# Altium schematic sheet PowerStage.SchDoc: <Project Name>
size A3; ApprovedBy: <Appr.>; Author: <Author>; CompanyName: Infineon Technologies AG; Engineer: <Rel.>; Organization: Infineon Technologies AG; Address1: IFAG DES S PS; Address2: Am Campeon 1-12  -  85579 Neubiberg  -  Germany; Address3: 85579 Neubiberg; Address4: Germany; DocumentNumber: 5; Revision: <Rev.>; SheetNumber: 5; SheetTotal: 9; Release: RC00; PageSetup: Record=PageOptions|CenterHorizontal=True|CenterVertical=True|PrintScale=1.01|XCorrection=1.00|YCorrection=1.00|PrintKind=0|BorderSize=5000000|LeftOffset=0|BottomOffset=0|Orientation=2|PaperLength=1000|PaperWidth=1000|Scale=100|PaperSource=7|PrintQuality=-4|MediaType=1|DitherType=10|PaperKind=A3|PrintScaleMode=1; Doc_ConfidentialStatus: <Doc_ConfidentialStatus>; Doc_Preliminary: <Doc_Preliminary>
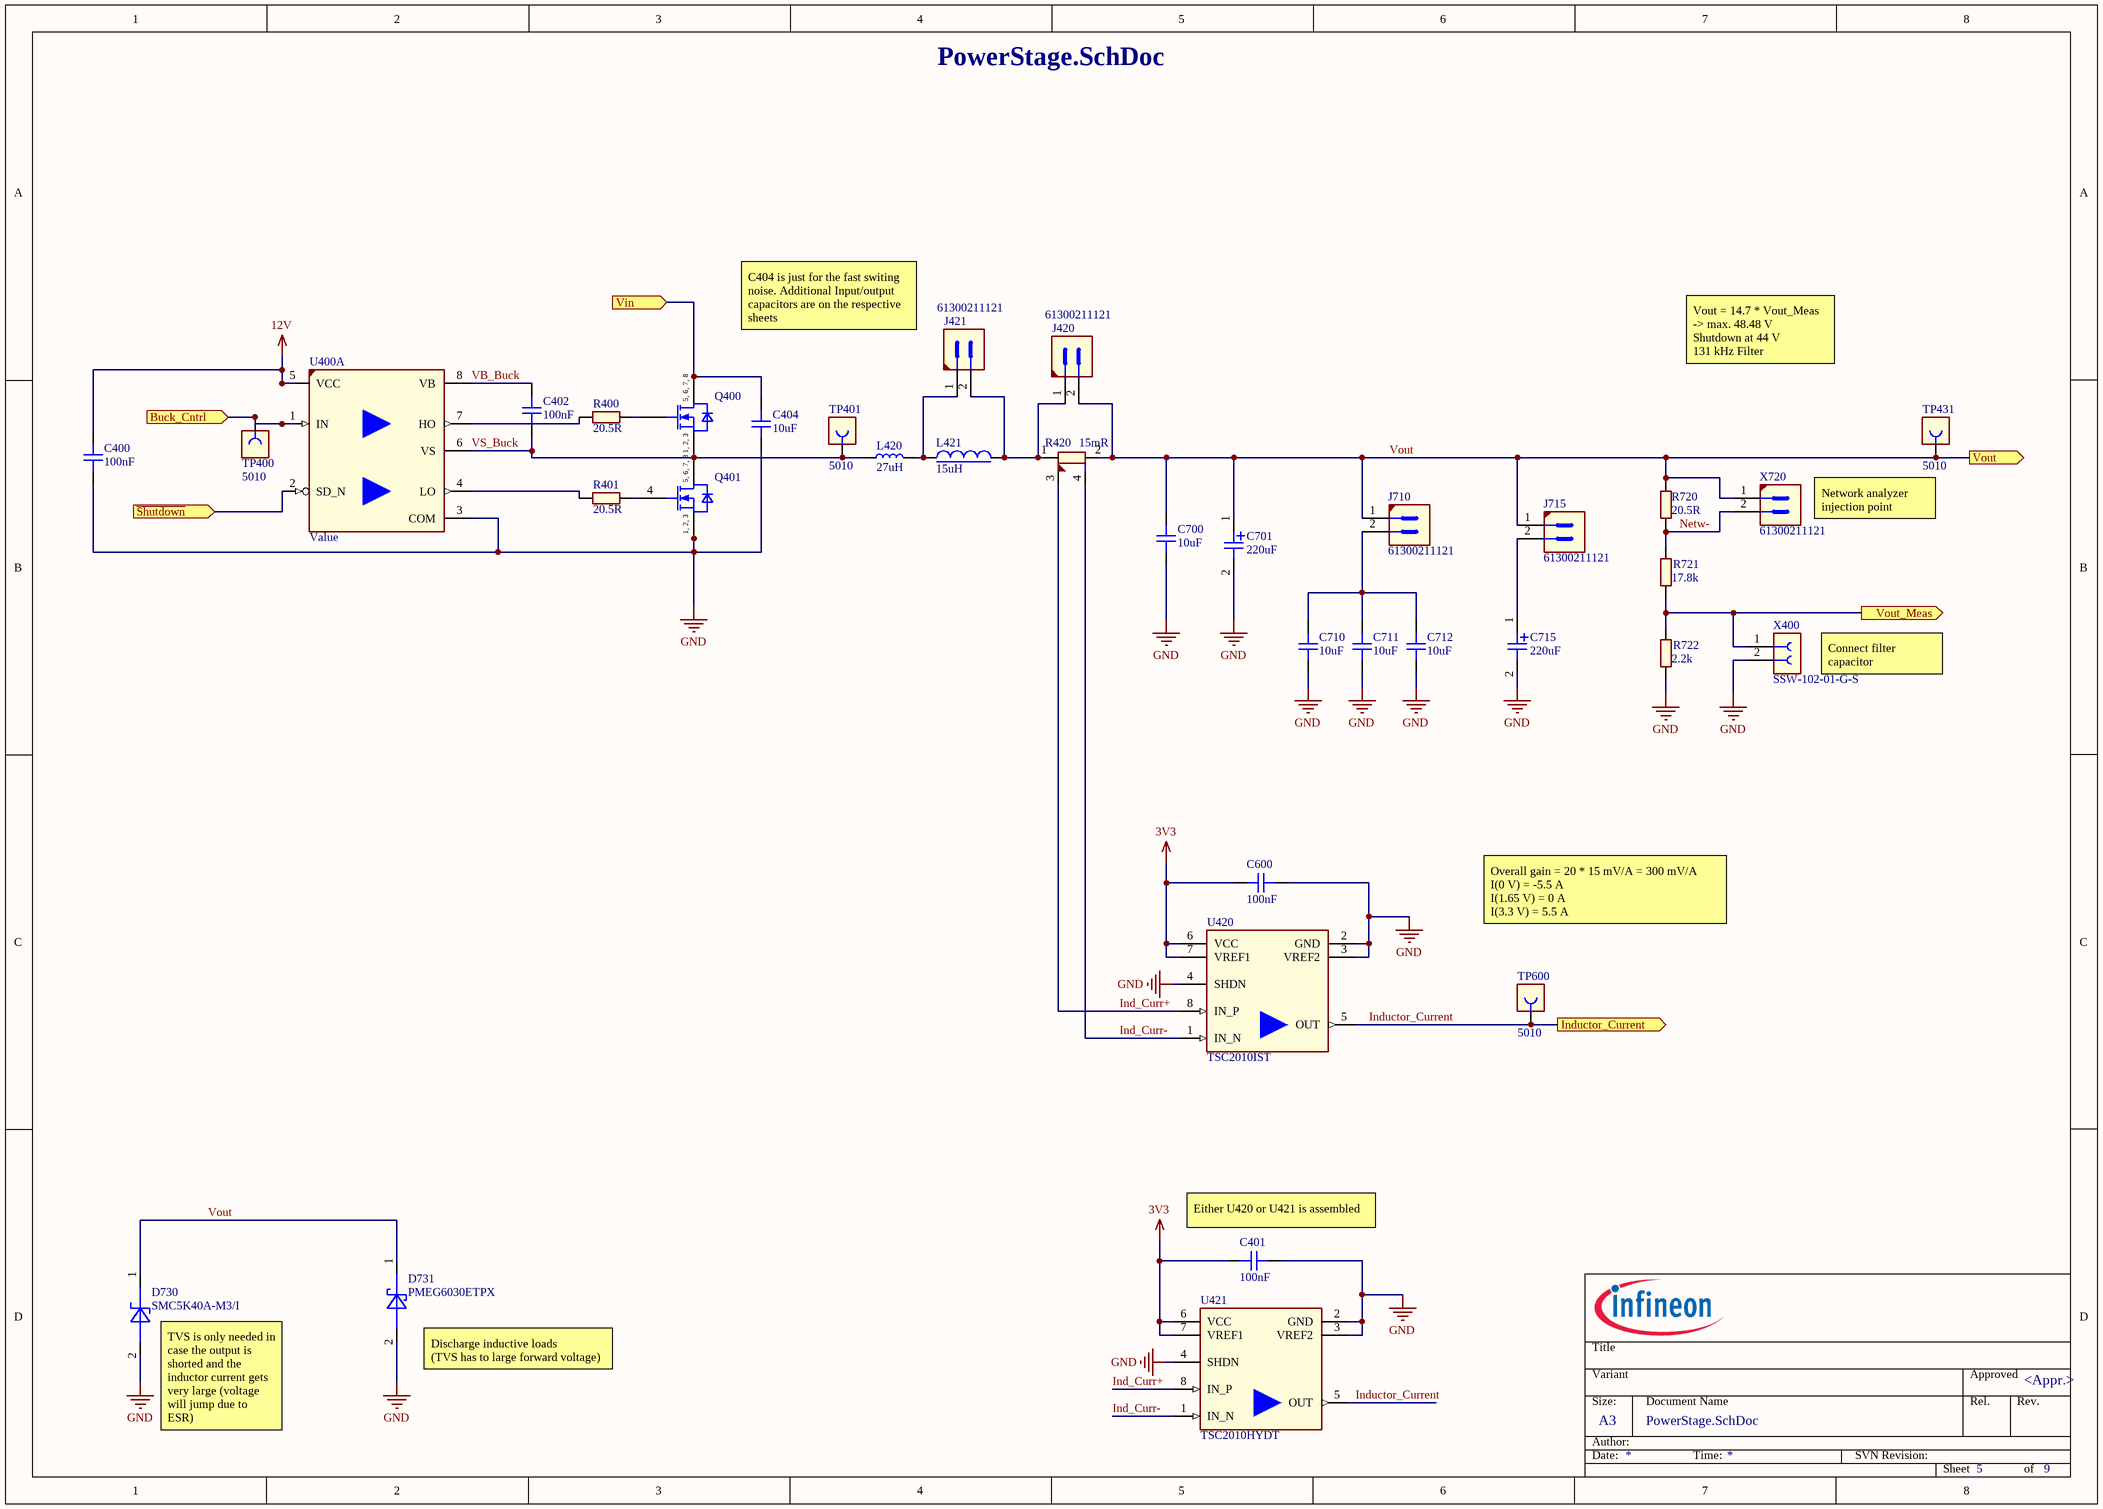
[diagram p0: PowerStage.SchDoc]

## Parts
C400  100nF  [CAPC3216X125N-0]
C401  100nF  [CAPC3216X125N-0]
C402  100nF  [CAPC3216X125N-0]
C404  10uF  [CAPC3216X190N-1]
C600  100nF  [CAPC3216X125N-0]
C700  10uF  [CAPC3216X190N-1]
C701  220uF  [CAPAE1030X1050N-3]
C710  10uF  [CAPC3216X190N-1]
C711  10uF  [CAPC3216X190N-1]
C712  10uF  [CAPC3216X190N-1]
C715  220uF  [CAPAE1030X1050N-3]
D730  SMC5K40A-M3/I  [DIOM7959X262N]
D731  PMEG6030ETPX  [SODFL4725X110N]
J420  61300211121  [CON-M-THT-61300211121]
J421  61300211121  [CON-M-THT-61300211121]
J710  61300211121  [CON-M-THT-61300211121]
J715  61300211121  [CON-M-THT-61300211121]
L420  27uH  [INDM120120X1000N]
L421  15uH  [IND-SMD-SRP6060FA]
Q400  igfet_n_ch_enh_dio_1s2s3s4g5d6d7d8d_8p  [INF-PG-PQFN-5X6BEG]  (value not drawn)
Q401  igfet_n_ch_enh_dio_1s2s3s4g5d6d7d8d_8p  [INF-PG-PQFN-5X6BEG]  (value not drawn)
R400  20.5R  [RESC3216X60N]
R401  20.5R  [RESC3216X60N]
R420  15mR  [RES-SMD-L4T12]
R720  20.5R  [RESC3216X60N]
R721  17.8k  [RESC3216X60N]
R722  2.2k  [RESC3216X60N]
TP400  5010  [CON-THT-TP-5010]
TP401  5010  [CON-THT-TP-5010]
TP431  5010  [CON-THT-TP-5010]
TP600  5010  [CON-THT-TP-5010]
U400  Value  [SOIC127P600X172-8N-1-V]  (part A of 3)
U420  TSC2010IST  [SOIC127P600X175-8N-16]
U421  TSC2010HYDT  [SOIC127P600X175-8N-16]
X400  SSW-102-01-G-S  [CON-F-THT-SSW-102-01-G-S]
X720  61300211121  [CON-M-THT-61300211121]

## Ports
Buck_Cntrl (in), Inductor_Current (out), Vin (in), Vout (out), Vout_Meas (out), ~{Shutdown} (in)

## Nets
3V3: C401.2 C600.2 U420.6(VCC) U420.7(VREF1) U421.6(VCC) U421.7(VREF1)
12V: C400.2 U400.5(VCC)
GND: C400.1 C401.1 C404.1 C600.1 C700.1 C701.2 C710.1 C711.1 C712.1 C715.2 D730.2(ANODE) D731.2(Anode) Q401.1(SOURCE) Q401.2(SOURCE) Q401.3(SOURCE) R722.2 U400.3(COM) U420.2(GND) U420.3(VREF2) U420.4(SHDN) U421.2(GND) U421.3(VREF2) U421.4(SHDN) X400.2
~{Shutdown}: U400.2(SD_N) ; port ~{Shutdown}
Buck_Cntrl: TP400.1 U400.1(IN) ; port Buck_Cntrl
Ind_Curr+: R420.3(I1) U420.8(IN_P) U421.8(IN_P)
Ind_Curr-: R420.4(I2) U420.1(IN_N) U421.1(IN_N)
Inductor_Current: TP600.1 U420.5(OUT) U421.5(OUT) ; port Inductor_Current
Netw-: R720.1 R721.2 X720.2
VB_Buck: C402.2 U400.8(VB)
Vin: C404.2 Q400.5(DRAIN) Q400.6(DRAIN) Q400.7(DRAIN) Q400.8(DRAIN) ; port Vin
Vout: C700.2 C701.1 D730.1(CATHODE) D731.1(Cathode) J420.2 J710.1 J715.1 R420.2(V2) R720.2 TP431.1 X720.1 ; port Vout
Vout_Meas: R721.1 R722.1 X400.1 ; port Vout_Meas
VS_Buck: C402.1 L420.1 Q400.1(SOURCE) Q400.2(SOURCE) Q400.3(SOURCE) Q401.5(DRAIN) Q401.6(DRAIN) Q401.7(DRAIN) Q401.8(DRAIN) TP401.1 U400.6(VS)
NetC710_2: C710.2 C711.2 C712.2 J710.2
NetC715_1: C715.1 J715.2
NetJ420_1: J420.1 J421.2 L421.2 R420.1(V1)
NetJ421_1: J421.1 L420.2 L421.1
NetQ400_4: Q400.4(GATE) R400.1
NetQ401_4: Q401.4(GATE) R401.1
NetR400_2: R400.2 U400.7(HO)
NetR401_2: R401.2 U400.4(LO)

## Notes on the sheet
- C404 is just for the fast switing noise. Additional Input/output capacitors are on the respective sheets
- Vout = 14.7 * Vout_Meas
  -> max. 48.48 V
  Shutdown at 44 V
  131 kHz Filter
- Network analyzer injection point
- (near X400) Connect filter capacitor
- Overall gain = 20 * 15 mV/A = 300 mV/A
  I(0 V) = -5.5 A
  I(1.65 V) = 0 A
  I(3.3 V) = 5.5 A
- (near C401) Either U420 or U421 is assembled
- (near D731) Discharge inductive loads
  (TVS has to large forward voltage)
- (near D730) TVS is only needed in case the output is shorted and the inductor current gets very large (voltage will jump due to ESR)
- Title
- Variant
- Approved
- Date:
- Author:
- Size:
- A3
- Document Name
- Time:
- SVN Revision:
- Rel.
- Rev.
- Sheet
- of
- (in symbol 584303) 5, 6, 7, 8; 1, 2, 3

## Library data of the parts
C400-C402 C600 = 282874: CAP / CERA / 100nF / 50V / 10% / X7R (EIA) / -55°C to 125°C / 1206(3216) / SMD / -; Multiple Parts: No; Legacy PartNumber: CAP01005660; Manufacturer: MuRata; Manufacturer Order Number: GRM31MR71H104KA01; Symbol Type: Capacitor; Single; Standard; 2 Pins; Alternate View: Yes; Article Number: 282874; Version Number: V01; Combined Parameters: TC:X7R (EIA);Tol.:-10%/+10%;Vdc:50V; QuickPick: 100nF / 50V / 10% / X7R (EIA) / 1206 (3216); Type: Standard; Style: Single; Package Metric: 3216; Package Imperial: 1206; ComponentStatus: Released; PLMStatus: Obsolete; Legacy DeviceID: CAP01005660; Part Type: Capacitor; Value: 100nF; Tolerance Neg: 10%; Tolerance Pos: 10%; Application: Standard; Technology: Ceramic; Temperature min: -55; Temperature max: 125; Temperature Range: Military; ROHS Compliant: Y; Automotive Qualified: No; PackageReference: 1206 (3216); ComponentLink1Description: Vendor WebSite; ComponentLink1URL: http://www.murata.com/; ComponentLink2Description: Datasheet; ComponentLink2URL: http://webnetprod.muc.infineon.com/PCBPortal_Prod/WorkFlows/AltiumComponent/StandardDocumentation?Versionid=282875; Supplier 1: Farnell; Supplier 2: DigiKey; Supplier 3: Mouser; Second Source allowed: Yes; Voltage DC (max): 50V; Package Description: Capacitor,non-polarized,Chip;3.20mm L X 1.60mm W X 1.25mm H
C404 C700 C710-C712 = 648992: CAP / CERA / 10uF / 50V / 20% / X5R (EIA) / -55°C to 85°C / 1206 (3216) / SMD / -; Multiple Parts: No; Manufacturer: Taiyo Yuden; Manufacturer Order Number: UMK316BBJ106ML-T; Symbol Type: Capacitor; Single; Standard; 2 Pins; Alternate View: Yes; Article Number: 648992; Version Number: V00; Combined Parameters: TC:X5R (EIA);Tol.:-20%/+20%;Vdc:50V; QuickPick: 10uF / 50V / 20% / X5R (EIA) / 1206 (3216); Type: Standard; Style: Single; ComponentStatus: Released; PLMStatus: Active; Part Type: Capacitor; Value: 10uF; Tolerance Neg: 20%; Tolerance Pos: 20%; Application: Standard; Technology: Ceramic; Temperature min: -55; Temperature max: 85; Temperature Range: Military; ROHS Compliant: Y; Automotive Qualified: No; PackageReference: 1206 (3216); ComponentLink1Description: Vendor WebSite; ComponentLink1URL: http://www.yuden.co.jp/or/product/; ComponentLink2Description: Datasheet; ComponentLink2URL: http://webnetprod.muc.infineon.com/PCBPortal_Prod/WorkFlows/AltiumComponent/StandardDocumentation?Versionid=648993; Supplier 1: Farnell; Supplier Part Number 1: 2779059; Supplier 2: DigiKey; Supplier Part Number 2: 587-3248-1-ND; Supplier 3: Mouser; Supplier Part Number 3: 963-UMK316BBJ106ML-T; Second Source allowed: Yes; Voltage DC (max): 50V; Package Description: Capacitor,non-polarized,Chip;3.20mm L X 1.60mm W X 1.90mm H
C701 C715 = 699376: CAP / ELCO / 220uF / 50V / 20% / Aluminiumelectrolytic / -55°C to 105°C / 10.30mm L X 10.30mm W X 10.50mm H / - / -; Multible Parts: No; Manufacturer: Nippon Chemi-Con; Manufacturer Order Number: EMZL500ARA221MJA0G; Symbol Type: Capacitor; Single; Polarized; 2 Pins; Pin 1 Positive; Alternate View: Yes; Article Number: 699376; Version Number: V00; Combined Parameters: TC:Aluminiumelectrolytic;Tol.:-20%/+20%;Vdc:50V; QuickPick: 220uF / 50V / 20% / Aluminiumelectrolytic / EMZL500ARA221MJA0G; Type: Polarized; Style: Single; Automotive Qualified: AEC Q200; ComponentStatus: Released; PLMStatus: Active; Part Type: Capacitor; Value: 220uF; Tolerance Neg: 20%; Tolerance Pos: 20%; Application: Standard; Technology: Electrolytic; Temperature min: -55; Temperature max: 105; Temperature Range: Military; ROHS Compliant: Y; PackageReference: EMZL500ARA221MJA0G; ComponentLink1Description: Vendor WebSite; ComponentLink1URL: http://www.chemi-con.co.jp/e/; ComponentLink2Description: Datasheet; ComponentLink2URL: http://webnetprod.muc.infineon.com/PCBPortal_Prod/WorkFlows/AltiumComponent/StandardDocumentation?Versionid=699377; Supplier 1: Farnell; Supplier 2: DigiKey; Supplier 3: Mouser; Supplier Part Number 3: 661-EMZL500ARA221MJA; Second Source allowed: Yes; Voltage DC (max): 50V; Package Description: Capacitor,Aluminum Electrolytic;10.30mm L X 10.30mm W X 10.50mm H
D730 = 646377: Surface Mount Transient Voltage Suppressors, Unidirectional, Very Fast Response Time; Manufacturer: Vishay; Symbol Type: Transient Voltage Suppressor Diode (TVS, TAZ), 1 Cathode, 2 Anode; Article Number: 646377; Version Number: V01; Combined Parameters: Vf:-;If:-;Ur:40V;Ir:-;Pmax:5kW; QuickPick: TVS Diode / SMC (DO-214AB); Type: TVS Diode; Style: Single; Automotive Qualified: AEC Q101; ComponentStatus: Released; PLMStatus: Active; Second Source allowed: Yes; Voltage DC (max): na; Part Type: Diode; Manufacturer Order Number: SMC5K40A-M3/I; Value: SMC5K40A-M3/I; Application: Switching; Temperature min: -55; Temperature max: 150; Temperature Range: Military; ROHS Compliant: Y; PackageReference: SMC (DO-214AB); ComponentLink1Description: Vendor WebSite; ComponentLink1URL: http://www.vishay.com; ComponentLink2Description: Datasheet; ComponentLink2URL: http://webnetprod.muc.infineon.com/PCBPortal_Prod/WorkFlows/AltiumComponent/StandardDocumentation?Versionid=646378; Supplier 1: Farnell; Supplier 2: DigiKey; Supplier Part Number 2: SMC5K40A-M3/IGICT-ND; Supplier 3: Mouser; Supplier Part Number 3: 78-SMC5K40A-M3/I; Package Description: Diode,Molded Body;7.94mm L X 5.905mm W X 2.62mm H
D731 = 646087: DIODE SCHOTTKY 60V 3A SOD128; Manufacturer: Nexperia; Symbol Type: Standard Schottky Diode Symbol, 1 Cathode, 2 Anode; Article Number: 646087; Version Number: V01; Combined Parameters: Vf:530mV;If:4.2A;Ur:60V;Ir:200uA;Pmax:750mW; QuickPick: Schottky Diode / SOD128; Type: Schottky Diode; Style: Single; Automotive Qualified: AEC Q101; ComponentStatus: Released; PLMStatus: Active; Second Source allowed: Yes; Voltage DC (max): na; Part Type: Diode; Manufacturer Order Number: PMEG6030ETPX; Value: PMEG6030ETPX; Application: Standard; Temperature min: -55; Temperature max: 175; Temperature Range: Military; ROHS Compliant: Y; PackageReference: SOD128; ComponentLink1Description: Vendor WebSite; ComponentLink1URL: http://www.nexperia.com; ComponentLink2Description: Datasheet; ComponentLink2URL: http://webnetprod.muc.infineon.com/PCBPortal_Prod/WorkFlows/AltiumComponent/StandardDocumentation?Versionid=646088; Supplier 1: Farnell; Supplier Part Number 1: 2311228; Supplier 2: DigiKey; Supplier Part Number 2: 1727-1348-1-ND; Supplier 3: Mouser; Supplier Part Number 3: 771-PMEG6030ETPX; Package Description: SODFL Diode;3.80mm W X 2.50mm L X 1.10mm H body
J420 J421 J710 J715 X720 = 386760: Header, 2.54mm Pitch, 2 pin, Vertical, Single Row; Legacy PartNumber: CON01500943; Manufacturer: Wurth Elektronik; Alternat View: Yes; Article Number: 386760; Version Number: V01; Legacy DeviceID: WE_61300211121; Combined Parameters: Board-to-Board Header (male);2x1;Mounting:THT;Orient:0° (vertical);Shielded:No; QuickPick: 0° (vertical) / Board-to-Board; Style: Strip; Automotive Qualified: No; ComponentStatus: Released; PLMStatus: Active; Voltage DC (max): na; Part Type: Connector; Manufacturer Order Number: 61300211121; Value: 61300211121; Type: Board-to-Board; Temperature min: -40; Temperature max: 105; Temperature Range: Industrial; ROHS Compliant: Y; ComponentLink1Description: Vendor WebSite; ComponentLink1URL: http://www.we-online.com; ComponentLink2Description: Datasheet; ComponentLink2URL: http://webnetprod.muc.infineon.com/PCBPortal_Prod/WorkFlows/AltiumComponent/StandardDocumentation?Versionid=386761; Supplier 1: Farnell; Supplier Part Number 1: 2356153; Supplier 2: DigiKey; Supplier Part Number 2: 732-5315-ND; Supplier 3: Mouser; Supplier Part Number 3: 710-61300211121; Second Source allowed: Yes; Package Description: Header, Vertical, 2.54mm Pitch; 2 Pins, Single row, 5.08mm L X 2.54mm W X 8.89mm H body
L420 = 657324: IND / STD / 27uH / 4.6A / 20% / -40°C to 125°C / 40mR / 1210 / Inductor,Molded Body;12.00mm L X 12.00mm W X 10.00mm H / SMD / -; Multiple Parts: No; Manufacturer: Wurth Elektronik; Manufacturer Order Number: 7447709270; Symbol Type: Inductor; Single; Standard; 2 Pins; Alternate View: Yes; Article Number: 657324; Version Number: V00; Combined Parameters: Tol.:-20%/+20%;Rdc:40mR;Idc:4.6A;Fres:8MHz; QuickPick: 27uH / Standard / 1210; Type: Standard; Style: Single; Automotive Qualified: AEC Q200; ComponentStatus: Released; PLMStatus: Active; Voltage DC (max): na; Part Type: Inductor; Value: 27uH; Tolerance Neg: 20%; Tolerance Pos: 20%; Application: Power Electronics; Technology: Wire Wound; Temperature min: -40; Temperature max: 125; Temperature Range: Automotive; ROHS Compliant: Y; PackageReference: 1210; ComponentLink1Description: Vendor WebSite; ComponentLink1URL: http://www.we-online.com; ComponentLink2Description: Datasheet; ComponentLink2URL: http://webnetprod.muc.infineon.com/PCBPortal_Prod/WorkFlows/AltiumComponent/StandardDocumentation?Versionid=657325; Supplier 1: Farnell; Supplier Part Number 1: 2211547; Supplier 2: DigiKey; Supplier Part Number 2: 732-4121-1-ND; Supplier 3: Mouser; Supplier Part Number 3: 710-7447709270; Second Source allowed: Yes; Package Description: Inductor,Molded Body;12.00mm L X 12.00mm W X 10.00mm H
L421 = 657326: IND / STD / 15uH / 5.8A / 20% / -55°C to 155°C / 43mR / 6.6 x 6.4 mm / Inductor, SMD, 2 pin, 6.40 mm L X 6.60 mm W X 6.00 mm H body / - / -; Multiple Parts: No; Manufacturer: Bourns; Manufacturer Order Number: SRP6060FA-150M; Symbol Type: Inductor; Single; Standard; Core; 2 Pins; Alternate View: Yes; Article Number: 657326; Version Number: V00; Combined Parameters: Tol.:-20%/+20%;Rdc:43mR;Idc:5.8A;Fres:11MHz; QuickPick: 15uH / Standard / 6.6 x 6.4 mm; Type: Standard; Style: Single; Automotive Qualified: AEC Q200; ComponentStatus: Released; PLMStatus: Active; Voltage DC (max): na; Part Type: Inductor; Value: 15uH; Tolerance Neg: 20%; Tolerance Pos: 20%; Application: Power Electronics; Technology: Wire Wound; Temperature min: -55; Temperature max: 155; Temperature Range: Military; ROHS Compliant: Y; PackageReference: 6.6 x 6.4 mm; ComponentLink1Description: Vendor WebSite; ComponentLink1URL: http://www.bourns.com; ComponentLink2Description: Datasheet; ComponentLink2URL: http://webnetprod.muc.infineon.com/PCBPortal_Prod/WorkFlows/AltiumComponent/StandardDocumentation?Versionid=657327; Supplier 1: Farnell; Supplier Part Number 1: 2901829; Supplier 2: DigiKey; Supplier Part Number 2: SRP6060FA-150MCT-ND; Supplier 3: Mouser; Supplier Part Number 3: 652-SRP6060FA-150M; Second Source allowed: Yes; Package Description: Inductor, SMD, 2 pin, 6.40 mm L X 6.60 mm W X 6.00 mm H body
Q400 Q401 = 584303: HEXFET Power MOSFET, VDS 60V, RDS(on) max 14.4 mO; Manufacturer: Infineon Technologies; Manufacturer Order Number: IRFH5406TRPbF; Symbol Type: Insulated-Gate Field-Effect Transistor (IGFET), N-Channel, Enhancement, Body Diode, Pin 1 Source, 2 Source, 3 Source, 4 Gate, 5 Drain, 6 Drain, 7 Drain, 8 Drain, 8 Pins; Article Number: 584303; Version Number: V01; Legacy DeviceID: IFX_IRFH5406TRPbF; Value: IRFH5406TRPbF; Combined Parameters: N-Channel Enhancement;Uds:60V;Id:40A;Rds:14.4R;P:46W; QuickPick: N-Channel Enhancement / 46W / 40A / 60V / PQFN-5X6; Type: N-Channel Enhancement; Style: Single; Automotive Qualified: No; ComponentStatus: Released; PLMStatus: Active; Second Source allowed: Yes; Voltage DC (max): na; Part Type: Transistor FET; Application: Power Supply; Temperature min: -55; Temperature max: 150; Temperature Range: Military; ROHS Compliant: Y; PackageReference: PQFN-5X6; ComponentLink1Description: Vendor WebSite; ComponentLink1URL: https://www.infineon.com/; ComponentLink2Description: Datasheet; ComponentLink2URL: http://webnetprod.muc.infineon.com/PCBPortal_Prod/WorkFlows/AltiumComponent/StandardDocumentation?Versionid=584304; Supplier 1: Farnell; Supplier Part Number 1: 2580010; Supplier 2: DigiKey; Supplier Part Number 2: IRFH5406TRPBFCT-ND; Supplier 3: Mouser; Supplier Part Number 3: 942-IRFH5406TRPBF; Package Description: Pullback Quad Flat No-Lead (PQFN); 4 pin, 6.00 mm L X 5.00 mm W X 0.90 mm H body
R400 R401 R720 = 352637: RES / STD / 20.5R / 250mW / 1% / 100ppm/K / -55°C to 155°C / 1206(3216) / SMD / -; Multiple Parts: No; Legacy PartNumber: RES01802548; Manufacturer: Vishay; Manufacturer Order Number: CRCW120620R5FK; Symbol Type: Resistor; Single; Standard; 2 Pins; Alternate View: Yes; Article Number: 352637; Version Number: V01; Combined Parameters: TCR:100ppm/K;Tol.:-1%/+1%;Vdc:200V;Idc:-;P:250mW; QuickPick: 20.5R / 1% / 0.25 / 1206 (3216); Style: Single; Automotive Qualified: AEC Q200; Package Metric: 3216; Package Imperial: 1206; ComponentStatus: Released; PLMStatus: Active; Voltage DC (max): 200V; Legacy DeviceID: RES01802548; Part Type: Resistor; Value: 20.5R; Tolerance Neg: 1%; Tolerance Pos: 1%; Type: Standard; Technology: Thick Film; Temperature min: -55; Temperature max: 155; Temperature Range: Military; ROHS Compliant: Y; PackageReference: 1206 (3216); ComponentLink1Description: Vendor WebSite; ComponentLink1URL: http://www.vishay.com; ComponentLink2Description: Datasheet; ComponentLink2URL: http://webnetprod.muc.infineon.com/PCBPortal_Prod/WorkFlows/AltiumComponent/StandardDocumentation?Versionid=352638; Supplier 1: Farnell; Supplier 2: DigiKey; Supplier 3: Mouser; Second Source allowed: Yes
R420 = 644055: RES / STD / 15mR / 500mW / 1% / 75ppm/K / -55°C to 155°C / 1206 (3216) / SMD / -; Multiple Parts: No; Manufacturer: Ohmite; Manufacturer Order Number: L4T12FR015FER; Symbol Type: Resistor; 4-Terminal (Shunt); Standard; 4 Pins; Alternate View: Yes; Article Number: 644055; Version Number: V01; Combined Parameters: TCR:75ppm/K;Tol.:-1%/+1%;Vdc:-;Idc:-;P:500mW; QuickPick: 15mR / 1% / 0.5 / 1206 (3216); Style: 4-Terminal (Shunt); ComponentStatus: Released; PLMStatus: Active; Part Type: Resistor; Value: 15mR; Tolerance Neg: 1%; Tolerance Pos: 1%; Type: Standard; Application: Precision; Technology: Thick Film; Temperature min: -55; Temperature max: 155; Temperature Range: Military; ROHS Compliant: Y; Automotive Qualified: No; PackageReference: 1206 (3216); ComponentLink1Description: Vendor WebSite; ComponentLink1URL: http://www.ohmite.com; ComponentLink2Description: Datasheet; ComponentLink2URL: http://webnetprod.muc.infineon.com/PCBPortal_Prod/WorkFlows/AltiumComponent/StandardDocumentation?Versionid=644056; Supplier 1: Farnell; Supplier Part Number 1: 3274221; Supplier 2: DigiKey; Supplier Part Number 2: 273-L4T12FR015FERCT-ND; Supplier 3: Mouser; Supplier Part Number 3: 284-L4T12FR015FER; Second Source allowed: Yes; Package Description: Resistor, SMD, 4 pin, 3.00 mm L X 1.60 mm W X 0.65 mm H body
R721 = 354312: RES / STD / 17.8k / 250mW / 1% / 100ppm/K / -55°C to 155°C / 1206(3216) / SMD / -; Multiple Parts: No; Legacy PartNumber: RES01802883; Manufacturer: Vishay; Manufacturer Order Number: CRCW120617K8FK; Symbol Type: Resistor; Single; Standard; 2 Pins; Alternate View: Yes; Article Number: 354312; Version Number: V01; Combined Parameters: TCR:100ppm/K;Tol.:-1%/+1%;Vdc:200V;Idc:-;P:250mW; QuickPick: 17.8k / 1% / 0.25 / 1206 (3216); Style: Single; Automotive Qualified: AEC Q200; Package Metric: 3216; Package Imperial: 1206; ComponentStatus: Released; PLMStatus: Active; Voltage DC (max): 200V; Legacy DeviceID: RES01802883; Part Type: Resistor; Value: 17.8k; Tolerance Neg: 1%; Tolerance Pos: 1%; Type: Standard; Technology: Thick Film; Temperature min: -55; Temperature max: 155; Temperature Range: Military; ROHS Compliant: Y; PackageReference: 1206 (3216); ComponentLink1Description: Vendor WebSite; ComponentLink1URL: http://www.vishay.com; ComponentLink2Description: Datasheet; ComponentLink2URL: http://webnetprod.muc.infineon.com/PCBPortal_Prod/WorkFlows/AltiumComponent/StandardDocumentation?Versionid=354313; Supplier 1: Farnell; Supplier 2: DigiKey; Supplier 3: Mouser; Second Source allowed: Yes
R722 = 353792: RES / STD / 2.2k / 250mW / 1% / 100ppm/K / -55°C to 155°C / 1206(3216) / SMD / -; Multiple Parts: No; Legacy PartNumber: RES01802779; Manufacturer: Vishay; Manufacturer Order Number: CRCW12062K20FK; Symbol Type: Resistor; Single; Standard; 2 Pins; Alternate View: Yes; Article Number: 353792; Version Number: V01; Combined Parameters: TCR:100ppm/K;Tol.:-1%/+1%;Vdc:200V;Idc:-;P:250mW; QuickPick: 2.2k / 1% / 0.25 / 1206 (3216); Style: Single; Automotive Qualified: AEC Q200; Package Metric: 3216; Package Imperial: 1206; ComponentStatus: Released; PLMStatus: Active; Voltage DC (max): 200V; Legacy DeviceID: RES01802779; Part Type: Resistor; Value: 2.2k; Tolerance Neg: 1%; Tolerance Pos: 1%; Type: Standard; Technology: Thick Film; Temperature min: -55; Temperature max: 155; Temperature Range: Military; ROHS Compliant: Y; PackageReference: 1206 (3216); ComponentLink1Description: Vendor WebSite; ComponentLink1URL: http://www.vishay.com; ComponentLink2Description: Datasheet; ComponentLink2URL: http://webnetprod.muc.infineon.com/PCBPortal_Prod/WorkFlows/AltiumComponent/StandardDocumentation?Versionid=353793; Supplier 1: Farnell; Supplier 2: DigiKey; Supplier 3: Mouser; Second Source allowed: Yes
TP400 TP401 TP431 TP600 = 382400: PC Test Point-Multipurpose THT, Red; Multiple Parts: No; Legacy PartNumber: CON01500529; Manufacturer: Keystone Electronics Corp.; Symbol Type: Connector, 1 Lead, Female; Alternate View: Yes; Article Number: 382400; Version Number: V01; Legacy DeviceID: KEY_5010; Combined Parameters: Board-to-Cable None (onboard);1x1;Mounting:THT;Orient:0° (vertical);Shielded:No; QuickPick: 0° (vertical) / Board-to-Cable; Style: Not Applicable; ComponentStatus: Released; PLMStatus: Active; Voltage DC (max): na; Part Type: Connector; Manufacturer Order Number: 5010; Value: 5010; Type: Board-to-Cable; Application: Test; Temperature min: 0; Temperature max: 0; Temperature Range: Military; ROHS Compliant: Y; Automotive Qualified: No; ComponentLink1Description: Vendor WebSite; ComponentLink1URL: http://www.keyelco.com/; ComponentLink2Description: Datasheet; ComponentLink2URL: http://webnetprod.muc.infineon.com/PCBPortal_Prod/WorkFlows/AltiumComponent/StandardDocumentation?Versionid=382401; Supplier 1: Farnell; Supplier Part Number 1: 2301288; Supplier 2: DigiKey; Supplier Part Number 2: 36-5010-ND; Supplier 3: Mouser; Supplier Part Number 3: 534-5010; Second Source allowed: Yes; Package Description: Test Point, 1.78 mm Lead Width, Round, 3.17 mm Dia X 8.28 mm H body
U400 = 583359: Driving IGBTs, enhancement mode N-Channel MOSFETs in various power electronic applications; Manufacturer: Infineon Technologies; Symbol type: 650 V half-bridge gate driver with integrated bootstrap diode; Alternate View: Yes; Article Number: 583359; Version Number: V01; Legacy DeviceID: IFX_2ED2184S06F; Value: 2ED2184S06F; Automotive Qualified: No; ComponentStatus: Released; PLMStatus: Active; Voltage DC (max): na; Multiple Parts: Yes; Part Type: Motors and Drives; Manufacturer Order Number: 2ED2184S06F; Type: Driver; Application: Industrial; Temperature min: -40; Temperature max: 125; Temperature Range: Automotive; ROHS Compliant: Y; PackageReference: PG-DSO-8-53; ComponentLink1Description: Vendor WebSite; ComponentLink1URL: https://www.infineon.com/; ComponentLink2Description: Datasheet; ComponentLink2URL: http://webnetprod.muc.infineon.com/PCBPortal_Prod/WorkFlows/AltiumComponent/StandardDocumentation?Versionid=583360; Supplier 1: Farnell; Supplier 2: DigiKey; Supplier Part Number 2: 448-2ED2184S06FXUMA1TR-ND; Supplier 3: Mouser; Supplier Part Number 3: 726-2ED2184S06FXUMA1; Second Source allowed: Yes; Package Description: SOIC,1.27mm pitch;8 pin,3.90mm W X 4.90mm L X 1.72mm H body
U420 = 687900: Precision bidirectional current sense amplifier; Manufacturer: STMicroelectronics; Symbole Type: High Temperature, High Voltage, Precision, Bidirectional Current Sense Amplifier; Alternate View: No; Article Number: 687900; Version Number: V00; Legacy DeviceID: ST_TSC2010IST; Combined Parameters: Res.:-;Fmax:-; QuickPick: Amplifier / MiniSO8; Automotive Qualified: AEC Q100; ComponentStatus: Released; PLMStatus: Active; Second Source allowed: Yes; Voltage DC (max): na; Multiple Parts: No; Part Type: Analog Parts; Manufacturer Order Number: TSC2010IST; Value: TSC2010IST; Type: Amplifier; Application: Power Electronics; Temperature min: -40; Temperature max: 150; Temperature Range: Automotive; ROHS Compliant: Y; PackageReference: MiniSO8; ComponentLink1Description: Vendor WebSite; ComponentLink1URL: http://www.st.com; ComponentLink2Description: Datasheet; ComponentLink2URL: http://webnetprod.muc.infineon.com/PCBPortal_Prod/WorkFlows/AltiumComponent/StandardDocumentation?Versionid=687901; Supplier 1: Farnell; Supplier Part Number 1: 3577226; Supplier 2: DigiKey; Supplier Part Number 2: 497-TSC2010ISTCT-ND; Supplier 3: Mouser; Supplier Part Number 3: 511-TSC2010IST; Package Description: SOP,0.65mm pitch;8 pin,3.00mm W X 3.00mm L X 1.10mm H body
U421 = 687895: Precision bidirectional current sense amplifier; Manufacturer: STMicroelectronics; Symbole Type: High Temperature, High Voltage, Precision, Bidirectional Current Sense Amplifier; Alternate View: No; Article Number: 687895; Version Number: V00; Legacy DeviceID: ST_TSC2010HYDT; Combined Parameters: Res.:-;Fmax:-; QuickPick: Amplifier / SOIC-8; Automotive Qualified: AEC Q100; ComponentStatus: Released; PLMStatus: Active; Second Source allowed: Yes; Voltage DC (max): na; Multiple Parts: No; Part Type: Analog Parts; Manufacturer Order Number: TSC2010HYDT; Value: TSC2010HYDT; Type: Amplifier; Application: Power Electronics; Temperature min: -40; Temperature max: 150; Temperature Range: Automotive; ROHS Compliant: Y; PackageReference: SOIC-8; ComponentLink1Description: Vendor WebSite; ComponentLink1URL: http://www.st.com; ComponentLink2Description: Datasheet; ComponentLink2URL: http://webnetprod.muc.infineon.com/PCBPortal_Prod/WorkFlows/AltiumComponent/StandardDocumentation?Versionid=687896; Supplier 1: Farnell; Supplier Part Number 1: 3864633RL; Supplier 2: DigiKey; Supplier Part Number 2: 497-TSC2010HYDTCT-ND; Supplier 3: Mouser; Supplier Part Number 3: 511-TSC2010HYDT; Package Description: SOIC,1.27mm pitch;8 pin,3.90mm W X 4.90mm L X 1.75mm H body
X400 = 614137: Through Hole .025'' SQ Post Socket, 2.54mm pitch, 2 Pins; Manufacturer: Samtec; Article Number: 614137; Version Number: V01; Legacy DeviceID: SAM_SSW-102-01-G-S; Combined Parameters: Board-to-Board/Cable Socket (female);2x1;Mounting:THT;Orient:0° (vertical);Shielded:Yes; QuickPick: 0° (vertical) / Board-to-Board/Cable; Style: Strip; Automotive Qualified: No; ComponentStatus: Released; PLMStatus: Active; Second Source allowed: Yes; Voltage DC (max): na; Part Type: Connector; Manufacturer Order Number: SSW-102-01-G-S; Value: SSW-102-01-G-S; Type: Board-to-Board/Cable; Application: Standard Interface; Temperature min: -55; Temperature max: 125; Temperature Range: Military; ROHS Compliant: Y; PackageReference: THT; ComponentLink1Description: Vendor WebSite; ComponentLink1URL: http://www.samtec.com/; ComponentLink2Description: Datasheet; ComponentLink2URL: http://webnetprod.muc.infineon.com/PCBPortal_Prod/WorkFlows/AltiumComponent/StandardDocumentation?Versionid=614138; Supplier 1: Farnell; Supplier Part Number 1: 200-SSW10201GS; Supplier 2: DigiKey; Supplier Part Number 2: SAM1209-02-ND; Supplier 3: Mouser; Supplier Part Number 3: 1668331; Package Description: Header, THT, 2.54mm pitch, 2 pin, 5.59mm L X 2.41mm W X 8.64mm H body